# EAGLE schematic Application (EAGLE 7.5.0)
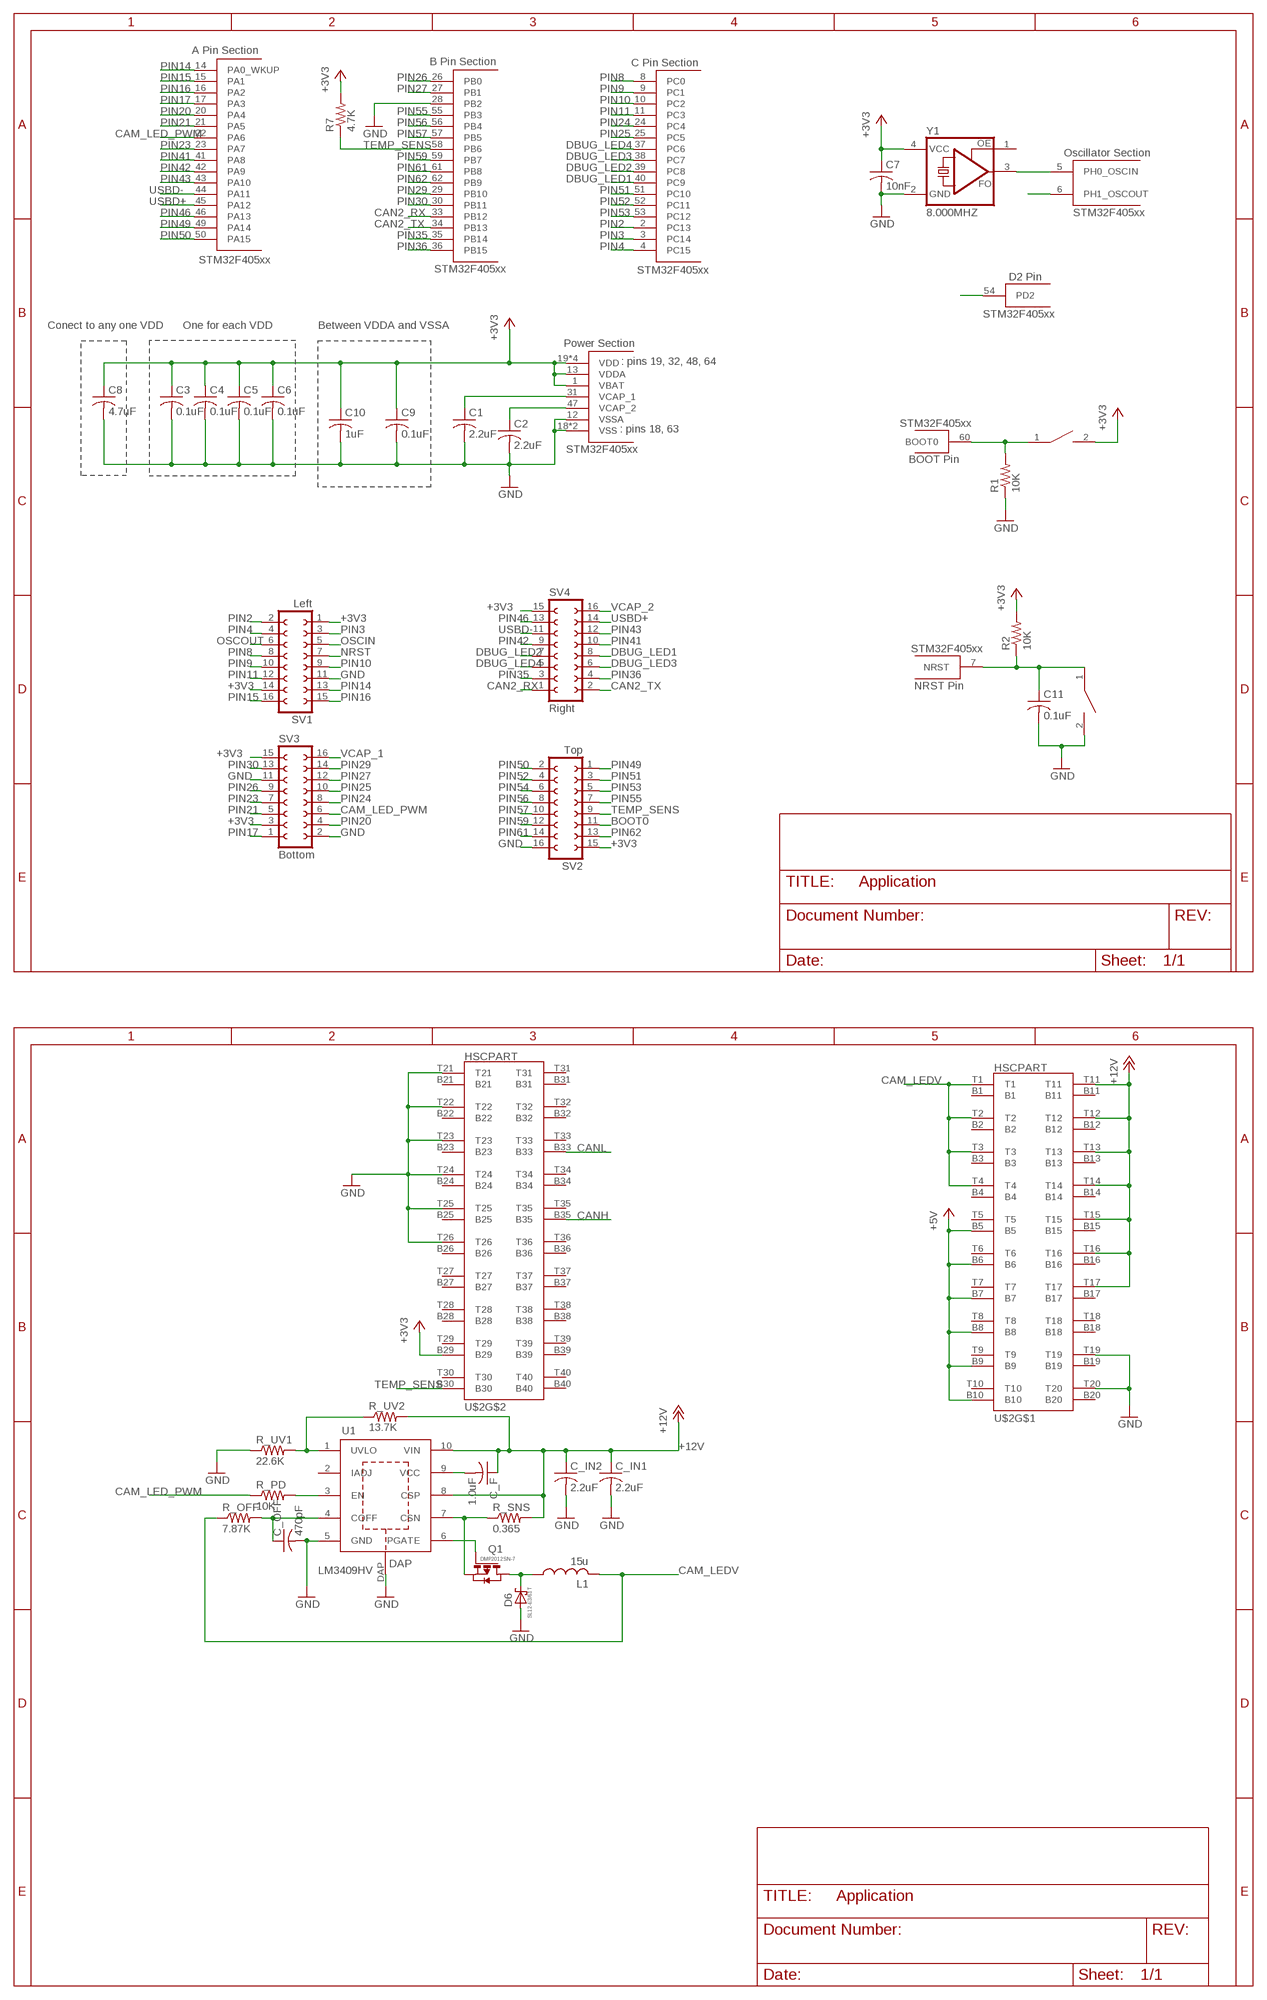
[diagram p0: schematic, sheet 1, part 1 of 2]
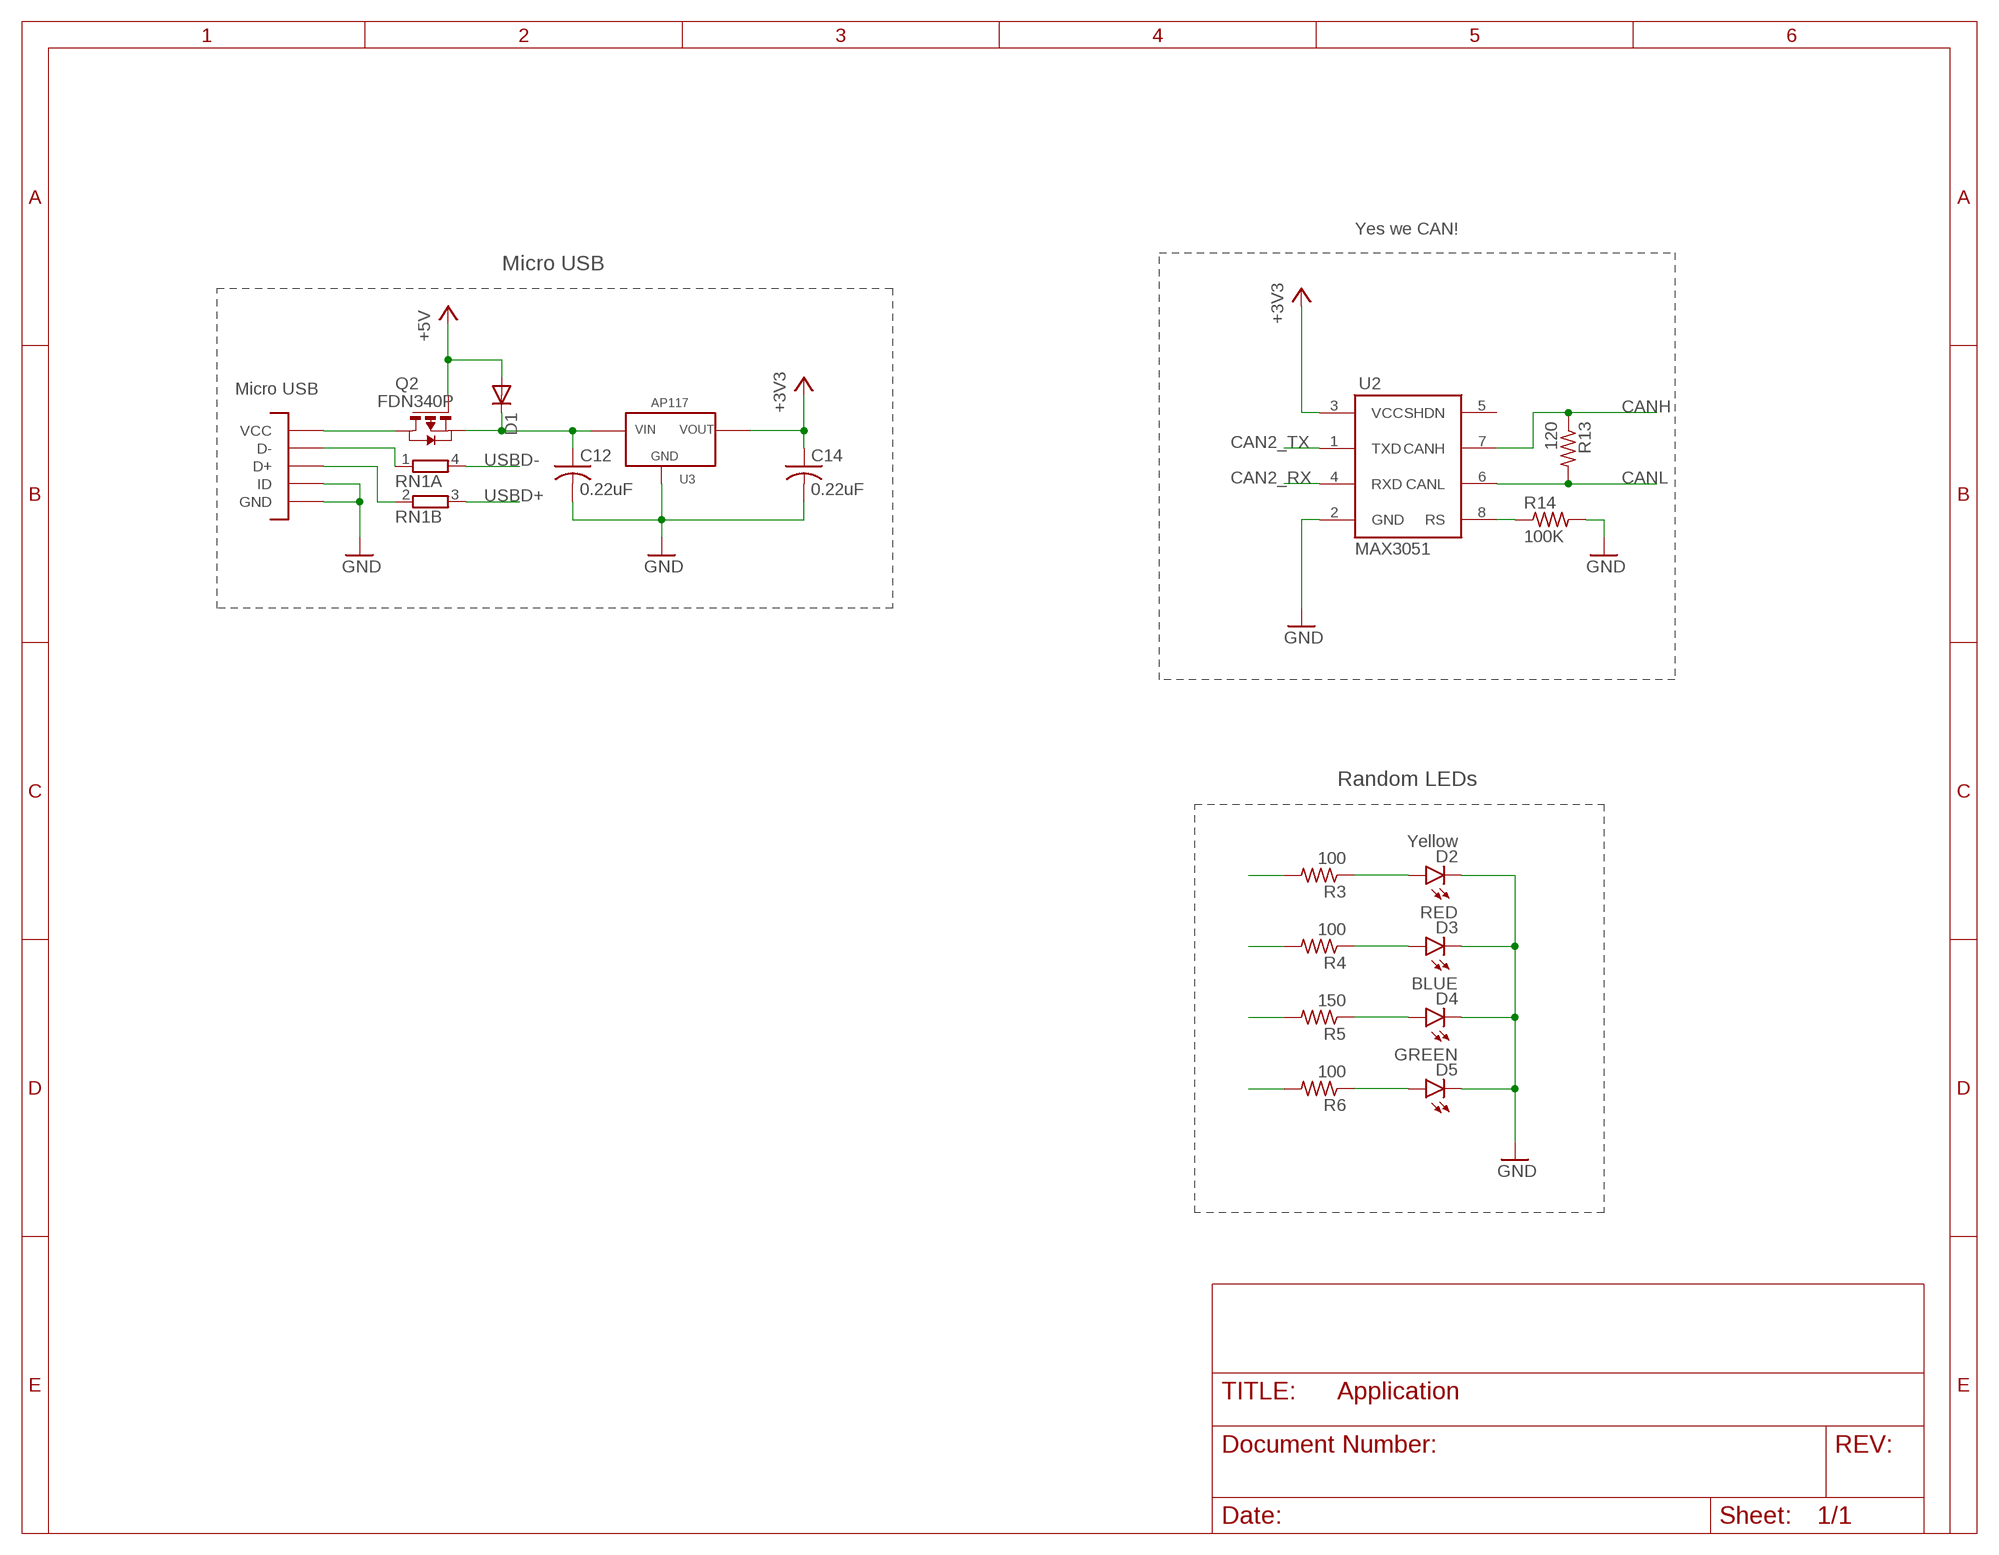
[diagram p1: schematic, sheet 1, part 2 of 2]

## Parts
C1  2.2uF  C-USC0603  [C0603]
C2  2.2uF  C-USC0603  [C0603]
C3  0.1uF  C-USC0603  [C0603]
C4  0.1uF  C-USC0603  [C0603]
C5  0.1uF  C-USC0603  [C0603]
C6  0.1uF  C-USC0603  [C0603]
C7  10nF  C-USC0603  [C0603]
C8  4.7uF  C-USC0603  [C0603]
C9  0.1uF  C-USC0603  [C0603]
C10  1uF  C-USC0603  [C0603]
C11  0.1uF  C-USC0603  [C0603]
C12  0.22uF  C-USC0603  [C0603]
C14  0.22uF  C-USC0603  [C0603]
C_F  1.0uF  C-USC0603  [C0603]
C_IN1  2.2uF  C-USC0603  [C0603]
C_IN2  2.2uF  C-USC0603  [C0603]
C_OFF  470pF  C-USC0603  [C0603]
D1  DIODE-DO-214AC  [DO-214AC]
D2  Yellow  LED-YELLOW0603  [LED-0603]
D3  RED  LED-RED0603  [LED-0603]
D4  BLUE  LED-BLUE0603  [LED-0603]
D5  GREEN  LED-GREEN0603  [LED-0603]
D6  SL12-E3/61T  [SL12-E3/61T]
L1  15u  SRN8040  [SRN8040]
Q1  DMP2012SN-7  [DMP2012SN-7]
Q2  FDN340P  [SOT-23]
R1  10K  R-US_R0603  [R0603]
R2  10K  R-US_R0603  [R0603]
R3  100  R-US_R0603  [R0603]
R4  100  R-US_R0603  [R0603]
R5  150  R-US_R0603  [R0603]
R6  100  R-US_R0603  [R0603]
R7  4.7K  R-US_R0603  [R0603]
R13  120  R-US_R0603  [R0603]
R14  100K  R-US_R0603  [R0603]
R_OFF  7.87K  R-US_R0603  [R0603]
R_PD  10K  R-US_R0603  [R0603]
R_SNS  0.365  R-US_R2512  [R2512]
R_UV1  22.6K  R-US_R0603  [R0603]
R_UV2  13.7K  R-US_R0603  [R0603]
RN1  2R-NEXBV4V  [EXBV4V]
S1  BOOT  SWITCH  [SW_2512]
S2  RESET  SWITCH  [SW_2512]
SV1  Left  FE08-2  [FE08-2]
SV2  Top  FE08-2  [FE08-2]
SV3  Bottom  FE08-2  [FE08-2]
SV4  Right  FE08-2  [FE08-2]
U1  LM3409HV  LM3409HV'LM3409HV'  [VSSOP-10]
U2  MAX3051  MAX3051MAX3051  [SOT23-8L]
U3  U3  AP1117_LIN_REG  [SOT223]
U4  STM32F405  [LQFP64]
U5  MICROUSB  [MICRO_B]
U$2  HSCPART  [HSC8-40PINOUUT]
Y1  8.000MHZ  ASF  [ASF]

## Nets
+3V3: C3.1 C4.1 C5.1 C6.1 C7.1 C8.1 C9.1 C10.1 C14.1 R2.2 R7.2 S1.2 SV1.1 SV1.14 SV2.15 SV3.3 SV3.15 SV4.15 U2.3(VCC) U3.TAB(VOUT) U3.VOUT U4.1(VBAT) U4.13(VDDA) U4.19(VDD) U4.32(VDD) U4.48(VDD) U4.64(VDD) U$2.B29 Y1.4(VCC)
+5V: D1.A Q2.3(G) U$2.B5 U$2.B6 U$2.B7 U$2.B8 U$2.B9 U$2.B10
+12V: C_F.1 C_IN1.1 C_IN2.1 R_SNS.2 R_UV2.2 U1.8(CSP) U1.10(VIN) U$2.T11 U$2.T12 U$2.T13 U$2.T14 U$2.T15 U$2.T16 U$2.T17
BOOT0: R1.2 S1.1 SV2.11 U4.60(BOOT0)
CAM_LED_PWM: R_PD.1 SV3.6 U4.22(PA6)
CAM_LEDV: L1.2 R_OFF.1 U$2.T1 U$2.T2 U$2.T3 U$2.T4
CAN2_RX: SV4.1 U2.4(RXD) U4.33(PB12)
CAN2_TX: SV4.2 U2.1(TXD) U4.34(PB13)
CANH: R13.1 U2.7(CANH) U$2.B35
CANL: R13.2 U2.6(CANL) U$2.B33
DBUG_LED1: R3.2 SV4.8 U4.40(PC9)
DBUG_LED2: R4.2 SV4.7 U4.39(PC8)
DBUG_LED3: R5.2 SV4.6 U4.38(PC7)
DBUG_LED4: R6.2 SV4.5 U4.37(PC6)
GND: C1.2 C2.2 C3.2 C4.2 C5.2 C6.2 C7.2 C8.2 C9.2 C10.2 C11.2 C12.2 C14.2 C_IN1.2 C_IN2.2 C_OFF.2 D2.C D3.C D4.C D5.C D6.2(A) R1.1 R14.2 R_UV1.1 S2.2 SV1.11 SV2.16 SV3.2 SV3.11 U1.5(GND) U1.DAP U2.2(GND) U3.GND U4.12(VSSA) U4.18(VSS) U4.28(PB2) U4.63(VSS) U5.GND1(GND) U5.GND2(GND) U5.GND3(GND) U5.GND4(GND) U5.GND7(GND) U5.GND8(GND) U5.P4(ID) U5.P5(GND) U$2.T19 U$2.T20 U$2.T21 U$2.T22 U$2.T23 U$2.T24 U$2.T25 U$2.T26 Y1.2(GND)
L1: D6.1(C) L1.1 Q1.1(D)
N$1: RN1.1 U5.P2(D-)
N$5: R_UV1.2 R_UV2.1 U1.1(UVLO)
N$6: C_OFF.1 R_OFF.2 U1.4(COFF)
N$7: C_F.2 U1.9(VCC)
N$8: Q1.3(S) R_SNS.1 U1.7(CSN)
N$9: R_PD.2 U1.3(EN)
N$10: Q1.2(G) U1.6(PGATE)
N$24: RN1.2 U5.P3(D+)
N$57: Q2.1(D) U5.P1(VCC)
N$58: C12.1 D1.C Q2.2(S) U3.VIN
N$59: D2.A R3.1
N$60: D3.A R4.1
N$61: D4.A R5.1
N$62: D5.A R6.1
N$63: R14.1 U2.8(RS)
NRST: C11.1 R2.1 S2.1 SV1.7 U4.7(NRST)
OSCIN: SV1.5 U4.5(PH0_OSCIN) Y1.3(FO)
OSCOUT: SV1.6 U4.6(PH1_OSCOUT)
PIN2: SV1.2 U4.2(PC13)
PIN3: SV1.3 U4.3(PC14)
PIN4: SV1.4 U4.4(PC15)
PIN8: SV1.8 U4.8(PC0)
PIN9: SV1.10 U4.9(PC1)
PIN10: SV1.9 U4.10(PC2)
PIN11: SV1.12 U4.11(PC3)
PIN14: SV1.13 U4.14(PA0_WKUP)
PIN15: SV1.16 U4.15(PA1)
PIN16: SV1.15 U4.16(PA2)
PIN17: SV3.1 U4.17(PA3)
PIN20: SV3.4 U4.20(PA4)
PIN21: SV3.5 U4.21(PA5)
PIN23: SV3.7 U4.23(PA7)
PIN24: SV3.8 U4.24(PC4)
PIN25: SV3.10 U4.25(PC5)
PIN26: SV3.9 U4.26(PB0)
PIN27: SV3.12 U4.27(PB1)
PIN29: SV3.14 U4.29(PB10)
PIN30: SV3.13 U4.30(PB11)
PIN35: SV4.3 U4.35(PB14)
PIN36: SV4.4 U4.36(PB15)
PIN41: SV4.10 U4.41(PA8)
PIN42: SV4.9 U4.42(PA9)
PIN43: SV4.12 U4.43(PA10)
PIN46: SV4.13 U4.46(PA13)
PIN49: SV2.1 U4.49(PA14)
PIN50: SV2.2 U4.50(PA15)
PIN51: SV2.3 U4.51(PC10)
PIN52: SV2.4 U4.52(PC11)
PIN53: SV2.5 U4.53(PC12)
PIN54: SV2.6 U4.54(PD2)
PIN55: SV2.7 U4.55(PB3)
PIN56: SV2.8 U4.56(PB4)
PIN57: SV2.10 U4.57(PB5)
PIN59: SV2.12 U4.59(PB7)
PIN61: SV2.14 U4.61(PB8)
PIN62: SV2.13 U4.62(PB9)
TEMP_SENS: R7.1 SV2.9 U4.58(PB6) U$2.B30
USBD+: RN1.3 SV4.14 U4.45(PA12)
USBD-: RN1.4 SV4.11 U4.44(PA11)
VCAP_1: C1.1 SV3.16 U4.31(VCAP_1)
VCAP_2: C2.1 SV4.16 U4.47(VCAP_2)
Unconnected: U1.2(IADJ) U2.5(SHDN) U$2.B1 U$2.B2 U$2.B3 U$2.B4 U$2.B11 U$2.B12 U$2.B13 U$2.B14 U$2.B15 U$2.B16 U$2.B17 U$2.B18 U$2.B19 U$2.B20 U$2.B21 U$2.B22 U$2.B23 U$2.B24 U$2.B25 U$2.B26 U$2.B27 U$2.B28 U$2.B31 U$2.B32 U$2.B34 U$2.B36 U$2.B37 U$2.B38 U$2.B39 U$2.B40 U$2.T5 U$2.T6 U$2.T7 U$2.T8 U$2.T9 U$2.T10 U$2.T18 U$2.T27 U$2.T28 U$2.T29 U$2.T30 U$2.T31 U$2.T32 U$2.T33 U$2.T34 U$2.T35 U$2.T36 U$2.T37 U$2.T38 U$2.T39 U$2.T40 Y1.1(OE)

## Notes on the sheet
- Yes we CAN!
- Micro USB
- Micro USB
- Conect to any one VDD | One for each VDD | Between VDDA and VSSA
- : pins 19, 32, 48, 64
- : pins 18, 63
- Random LEDs

## Library data of the parts
C1-C12 C14 = rcl:C-US: CAPACITOR, American symbol
C_F C_IN1 C_IN2 C_OFF = resistor:C-US: CAPACITOR, American symbol
D1 = DiscreteComponents:DIODE-: DIODE
D2 = SparkFun-LED:LED-YELLOW: Yellow SMD LEDs LilyPad 1206- DIO-09909 0603- DIO-09003 "SMART" means more efficient and expensive; PROD_ID: DIO-09003
D3 = SparkFun-LED:LED-RED: Assorted Red LEDs LilyPad 1206- DIO-09912 1206- DIO-00809 0603- DIO-00819 "SMART" means more efficient and expensive; PROD_ID: DIO-00819
D4 = SparkFun-LED:LED-BLUE: Blue LEDs for production use Various blue LEDs stocked by SparkFun production 0603 - DIO-08575 Rebel - DIO-09553 1206 - DIO-09911; PROD_ID: DIO-08575
D5 = SparkFun-LED:LED-GREEN: Various green LEDs Green LEDs used in SFE Production 0603- DIO-00821 LARGE- DIO-00862 LILYPAD- DIO-09910; PROD_ID: DIO-00821
D6 = DiscreteComponents:SL12-E3/61T
L1 = DiscreteComponents:SRN8040
Q1 = DiscreteComponents:DMP2012SN-7
Q2 = DiscreteComponents:FDN340P: MOS FET; DIGIKEY: FDN340PCT-ND
R1-R7 R13 R14 = rcl:R-US_: RESISTOR, American symbol
R_OFF R_PD R_SNS R_UV1 R_UV2 = DiscreteComponents:R-US_: RESISTOR, American symbol
RN1 = DiscreteComponents:2R-N: Array Chip Resistor; DIGIKEY: RHM1381CT-ND; MF: Rohm Semiconductor; MPN: MNR12ERAPJ220
S1 S2 = DiscreteComponents:SWITCH
SV1-SV4 = con-lsta:FE08-2: FEMALE HEADER; OC_FARNELL: unknown; OC_NEWARK: unknown
U1 = 2015_LED_Driver:LM3409HV
U2 = MAX3051 Library:MAX3051: Maxim Integrated MAX3051 CAN Tranciever
U3 = PowerComponents:AP1117_LIN_REG
U4 = Other:STM32F405
U5 = Other:MICROUSB
U$2 = Connectors:HSCPART
Y1 = DiscreteComponents:ASF*: CRYSTAL CLOCK OSCILLATORS 5.0 Vdc or 3.3 Vdc - LOW PROFILE ULTRA MINIATURE CERAMIC SURFACE MOUNT Source: http://www.abracon.com/Oscillators/asf1-L-L1.pdf; DIGIKEY: 535-10066-1-ND